# EAGLE design 5v_Buck_reg (EAGLE 4.16)
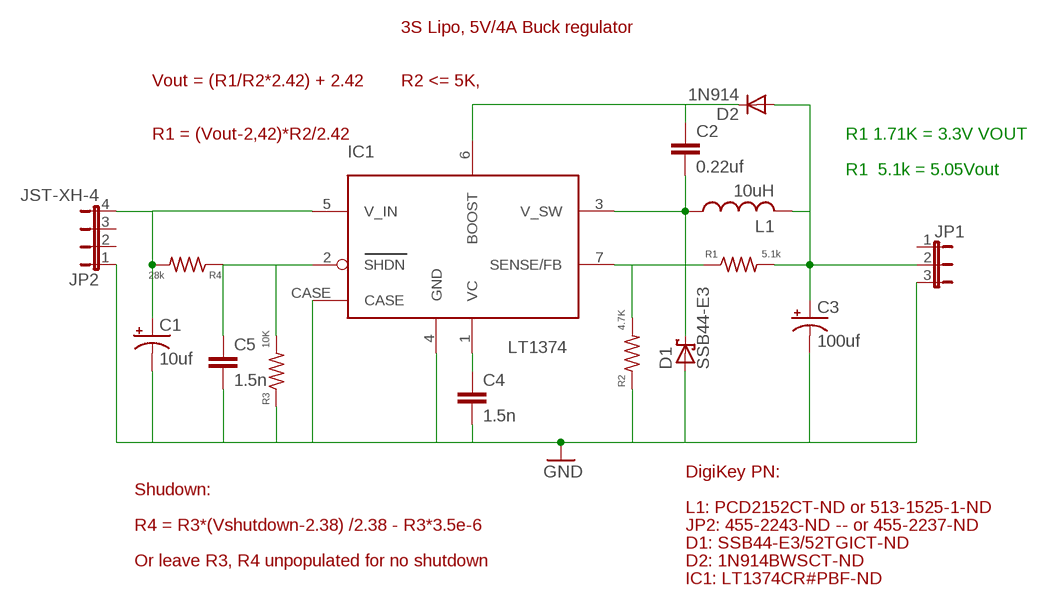
[diagram p0: schematic, sheet 1]

## Parts
C1  10uf  CPOL-USSMCD  [SMC_D]
C2  0.22uf  C-EUC1210K  [C1210K]
C3  100uf  CPOL-USE/7260-38W  [E/7260-38W]
C4  1.5n  C-EUC1206K  [C1206K]
C5  1.5n  C-EUC1206K  [C1206K]
D1  SSB44-E3  SCHOTTKY-DIODESMB  [SMB]
D2  1N914  DIODE-SOD323-W  [SOD323-W]
IC1  LT1374  [DD_PACK_7]
JP1  JP2E  [JP2]
JP2  JST-XH-4  JP4E  [JP4]
L1  10uH  INDUCTOR_SMDDR125  [DR125]
R1  5.1k  R-US_R0805  [R0805]
R2  4.7K  R-US_R0805  [R0805]
R3  10K  R-US_R0805  [R0805]
R4  28k  R-US_R0805  [R0805]

## Nets
GND: C1.- C3.- C4.2 C5.2 D1.A IC1.4(GND) IC1.CASE JP1.3 JP2.1 R2.1 R3.1
N$1: C2.2 D1.C IC1.3(V_SW) L1.P$1
N$2: C4.1 IC1.1(VC)
N$3: C3.+ D2.A JP1.2 L1.P$2 R1.2
N$4: C2.1 D2.C IC1.6(BOOST)
N$5: C1.+ IC1.5(V_IN) JP2.4 R4.2
N$6: IC1.7(SENSE/FB) R1.1 R2.2
N$7: C5.1 IC1.2(SHDN) R3.2 R4.1
Unconnected: JP1.1 JP2.2 JP2.3

## Notes on the sheet
- 3S Lipo, 5V/4A Buck regulator
- Vout = (R1/R2*2.42) + 2.42 | R2 <= 5K,
- R1 = (Vout-2,42)*R2/2.42 | R1 1.71K = 3.3V VOUT
- R1  5.1k = 5.05Vout
- DigiKey PN:
- Shudown:
- L1: PCD2152CT-ND or 513-1525-1-ND
- R4 = R3*(Vshutdown-2.38) /2.38 - R3*3.5e-6 | JP2: 455-2243-ND -- or 455-2237-ND
- D1: SSB44-E3/52TGICT-ND
- Or leave R3, R4 unpopulated for no shutdown | D2: 1N914BWSCT-ND
- IC1: LT1374CR#PBF-ND

## Library data of the parts
C1 C3 = rcl:CPOL-US: POLARIZED CAPACITOR, American symbol
C2 C4 C5 = rcl:C-EU: CAPACITOR, European symbol
D1 = diode:SCHOTTKY-DIODE: Schottky Diode
D2 = diode:DIODE-: DIODE
IC1 = ZStofer:LT1374
JP1 = jumper:JP2E: JUMPER
JP2 = jumper:JP4E: JUMPER
L1 = ZStofer:INDUCTOR_SMD: INDUCTOR, American symbol
R1-R4 = rcl:R-US_: RESISTOR, American symbol

## Board
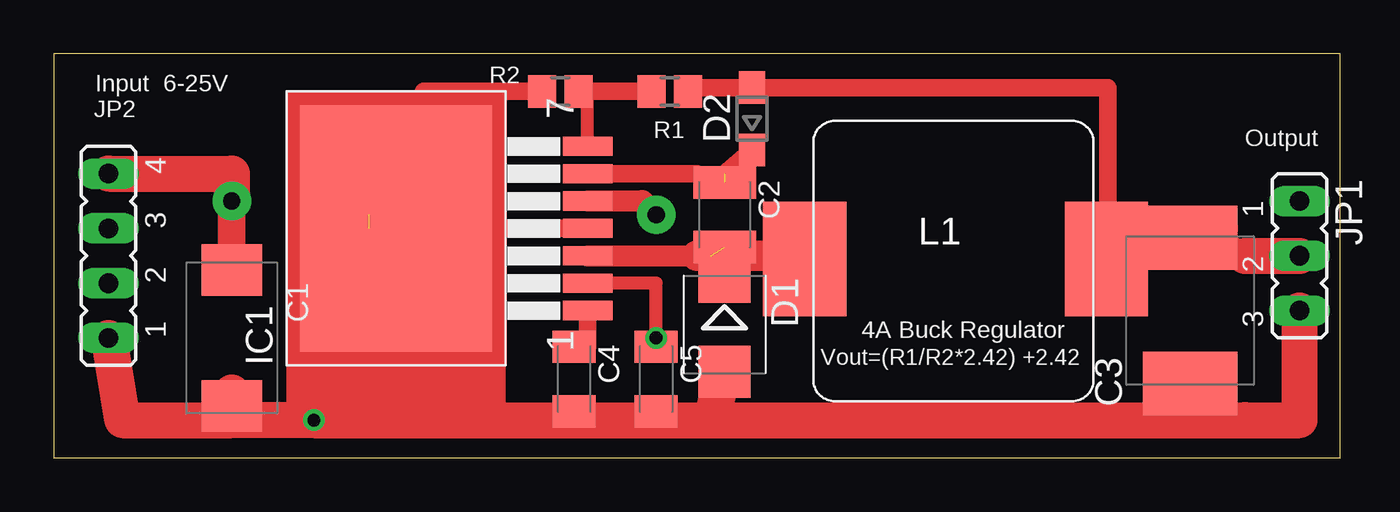
[diagram p1: board, top side]
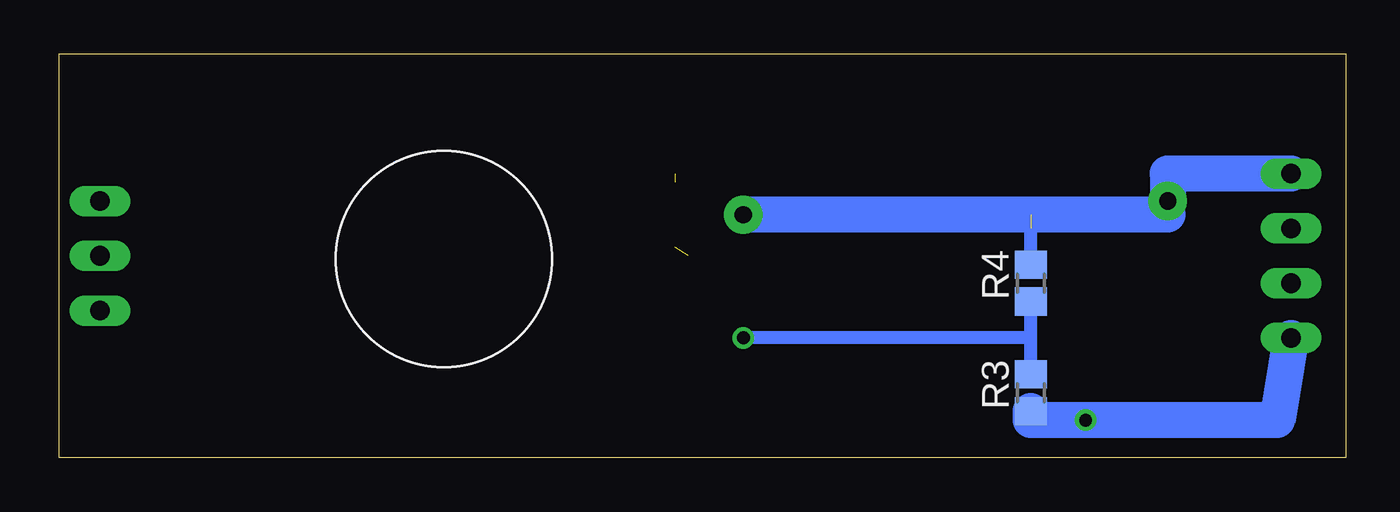
[diagram p2: board, bottom side, seen from below]

Size 59.67 x 18.72 mm. Coordinates in mm from the lower left corner, seen from the top.
Outline: 0,0 59.67,0 59.67,18.72 0,18.72 0,0
Copper layers (1*2+15*16): Top 0.035mm / dielectric 0.2mm / Route2 0.035mm / dielectric 0.15mm / Route15 0.035mm / dielectric 0.2mm / Bottom 0.035mm
Design rules "default": minimum track width 10mil, minimum drill 24mil, track to track 8mil, track to pad 8mil, pad to pad 8mil, via to via 8mil, smd to smd 8mil, copper to edge 40mil, drill to drill 8mil, minimum pad ring 10mil, minimum via ring 8mil, stop-mask expansion 4mil, vias tented up to drill 0mil, thermal gap 10mil

### Footprints (pad centres in the part's own frame; a part is rotated, then mirrored left to right if it is on the bottom)
SMC_D = smd 2.4 x 2.8: + -3.15,0; - 3.15,0
C1210K = smd 1.5 x 2.9: 1 -1.5,0; 2 1.5,0
E/7260-38W = smd 2.95 x 4.4: + 3.375,0; - -3.375,0
C1206K = smd 1.5 x 2: 1 -1.5,0; 2 1.5,0
SMB = smd 2.4 x 2.4: A 2.2,0; C -2.2,0
SOD323-W = smd 1.5 x 1.2: A 1.45,0; C -1.45,0
DD_PACK_7 = smd 0.889 x 2.286: 1 -3.81,-6.35; 2 -2.54,-6.35; 3 -1.27,-6.35; 4 0,-6.35; 5 1.27,-6.35; 6 2.54,-6.35; 7 3.81,-6.35 | smd 11.43 x 8.89: CASE 0,2.54
JP2 = drill 0.914 long: 1 -2.54,0; 2 0,0; 3 2.54,0
JP4 = drill 0.914 long: 1 -3.81,0; 2 -1.27,0; 3 1.27,0; 4 3.81,0
DR125 = smd 3.85 x 5.3: P$1 -7.08,0.49; P$2 6.92,0.49
R0805 = smd 1.3 x 1.5: 1 -0.85,0; 2 0.85,0

### Placement (x,y rotation side)
C1  8.25,5.55 270 top
C2  31.11,11.27 270 top
C3  52.7,6.82 90 top
C4  24.12,3.64 270 top
C5  27.93,3.64 270 top
D1  31.11,6.18 270 top
D2  32.38,15.71 90 top
IC1  18.41,10.63 90 top
JP1  57.78,9.36 270 top
JP2  2.54,9.36 90 top
L1  41.91,8.72 0 top
R1  28.57,16.98 0 top
R2  23.49,16.98 0 top
R3  14.6,3.01 90 bottom
R4  14.6,8.09 90 bottom

### Tracks (layer width: path | path; a pad name or v marks a point on that pad's centre or on a via)
GND  (via drill 0.6)
  Top 0: C3.- 53.53,3.44 55.24,1.74
  Top 0.813: IC1.CASE 17.14,10.63 | 17.14,10.63 IC1.4 | R2.1 17.14,16.98 17.14,10.63 | C5.2 24.76,1.74 v12.06,1.74 8.25,1.74
  Top 0.965: 8.25,1.74 8.25,3.01
  Top 1.27: C4.2 25.39,1.74 24.76,1.74
  Top 1.676: 8.25,1.74 C1.- 8.25,3.01 | 8.25,1.74 v12.06,1.74 14.6,1.74 | 30.47,1.74 24.76,1.74 14.6,1.74 | 30.47,1.74 55.24,1.74 57.78,1.74 JP1.3 | 14.6,1.74 14.6,10.63 | 30.47,1.74 D1.A | JP2.1 3.17,1.74 8.25,1.74
  Top 1.778: 14.6,10.63 IC1.CASE
  Bottom 1.676: R3.1 14.6,1.74 v12.06,1.74 3.17,1.74 JP2.1
N$1  (1 unrouted)
  Top 0.965: IC1.3 29.84,9.36
  Top 1.27: D1.C 30.47,9.36 29.84,9.36
  Top 1.422: L1.P$1 34.83,9.36 29.84,9.36
N$2
  Top 0.813: C4.1 24.76,5.14 IC1.1
N$3
  Top 0.61: R1.2 29.84,16.98 29.84,17.16
  Top 0.813: 29.84,17.16 D2.A 48.89,17.16 48.89,9.36 48.89,9.21 L1.P$2
  Top 1.422: C3.+ 55.24,9.36
  Top 1.676: 55.24,9.36 JP1.2
  Top 1.93: C3.+ 53.97,10.63 48.89,10.63 48.89,9.36 48.83,9.36 L1.P$2
N$4  (1 unrouted)
  Top 0.61: 29.84,13.17 31.11,13.17
  Top 0.813: IC1.6 29.84,13.17 | 31.11,13.17 D2.C
N$5  (via drill 0.8 pad 1.78)  (1 unrouted)
  Top 0.965: 27.3,11.9 IC1.5
  Top 1.016: v27.93,11.27 27.3,11.9
  Top 1.27: v8.25,11.9 C1.+
  Top 1.676: JP2.4 8.25,13.17 v8.25,11.9
  Bottom 0.61: R4.2 14.6,10.63
  Bottom 1.27: v8.25,11.9 8.25,11.27
  Bottom 1.676: 8.25,11.27 14.6,11.27 v27.93,11.27 | JP2.4 8.25,13.17 v8.25,11.9
N$6
  Top 0.61: R2.2 24.76,16.98 IC1.7
  Top 0.813: 24.76,16.98 R1.1
N$7  (via drill 0.6)
  Top 0.61: IC1.2 27.93,8.09 v27.93,5.55 | C5.1 v27.93,5.55 | C5.1 27.93,4.91 | C5.1 v27.93,5.55
  Bottom 0.61: R3.2 14.6,5.55 | 14.6,5.55 R4.1 | 14.6,5.55 v27.93,5.55
(copper drawn outside any net)
  shapes: Top area x1

### Text on the board
tPlace: Input | 6-25V | Output | 4A Buck Regulator | Vout=(R1/R2*2.42) +2.42
Drill_legend: Drill legend | Date: 6/06/2010 11:22:09a | 0.9144 mm / 36.000 mil | 0.8000 mm / 31.496 mil | 0.6000 mm / 23.622 mil